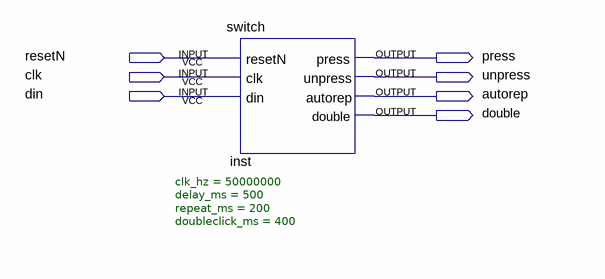
[diagram p0: schematic sheet]
// Quartus schematic switch_test.bdf as structural Verilog: 1 symbols, 7 pins
module switch_test (
  input  resetN,
  input  clk,
  input  din,
  output press,
  output unpress,
  output autorep,
  output double
);

  switch #(.clk_hz(50000000), .delay_ms(500), .repeat_ms(200), .doubleclick_ms(400)) inst (
    .resetN(resetN), .clk(clk), .din(din), .press(press), .unpress(unpress), .autorep(autorep),
    .double(double));
endmodule
